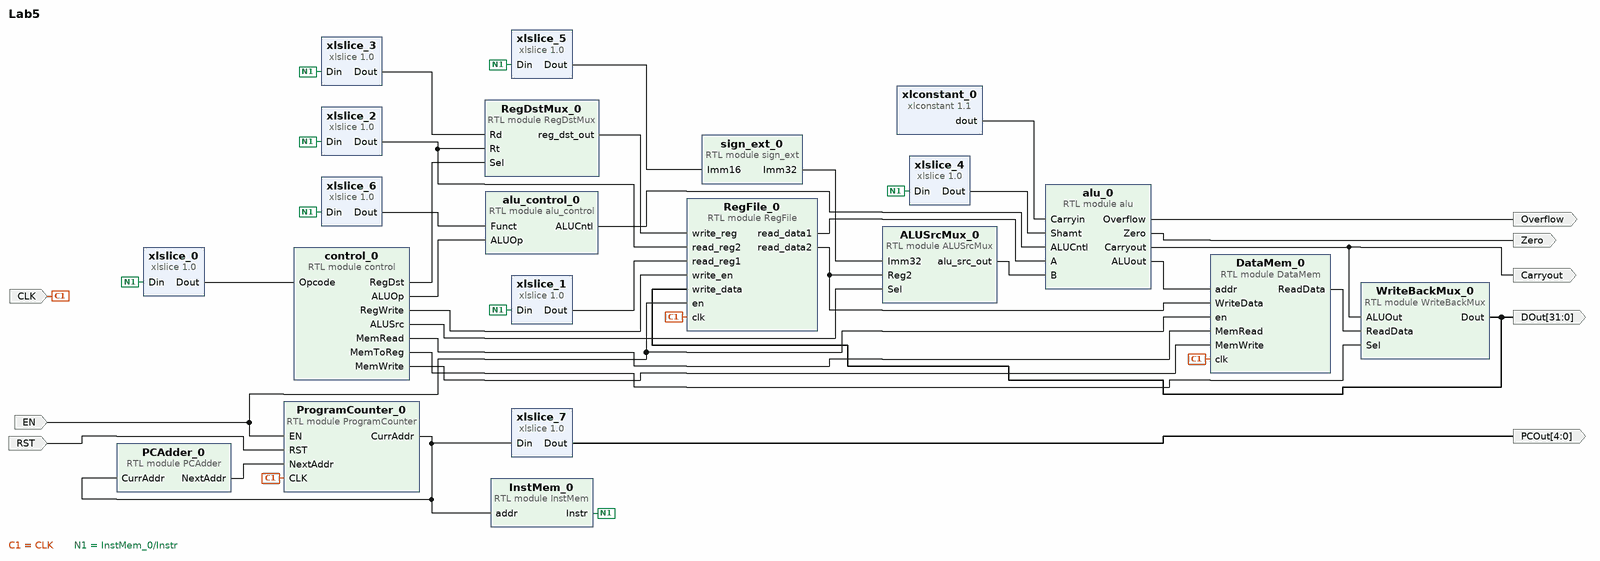
[diagram p0: block diagram of the top level]
# Vivado block design Lab5, xc7a35tcpg236-1, Vivado 2023.1.1
create_bd_design Lab5

create_bd_port -dir I RST
create_bd_port -dir I EN
create_bd_port -dir I CLK
create_bd_port -dir O -from 4 -to 0 PCOut
create_bd_port -dir O -from 31 -to 0 DOut
create_bd_port -dir O Carryout
create_bd_port -dir O Zero
create_bd_port -dir O Overflow

create_bd_cell -type module -reference ProgramCounter ProgramCounter_0
create_bd_cell -type module -reference PCAdder PCAdder_0
create_bd_cell -type ip -vlnv xilinx.com:ip:xlslice:1.0 xlslice_0
set_property -dict {CONFIG.DIN_FROM 31 CONFIG.DIN_TO 26} [get_bd_cells xlslice_0]
create_bd_cell -type ip -vlnv xilinx.com:ip:xlslice:1.0 xlslice_1
set_property -dict {CONFIG.DIN_FROM 25 CONFIG.DIN_TO 21} [get_bd_cells xlslice_1]
create_bd_cell -type ip -vlnv xilinx.com:ip:xlslice:1.0 xlslice_2
set_property -dict {CONFIG.DIN_FROM 20 CONFIG.DIN_TO 16} [get_bd_cells xlslice_2]
create_bd_cell -type ip -vlnv xilinx.com:ip:xlslice:1.0 xlslice_3
set_property -dict {CONFIG.DIN_FROM 15 CONFIG.DIN_TO 11} [get_bd_cells xlslice_3]
create_bd_cell -type ip -vlnv xilinx.com:ip:xlslice:1.0 xlslice_4
set_property -dict {CONFIG.DIN_FROM 10 CONFIG.DIN_TO 6} [get_bd_cells xlslice_4]
create_bd_cell -type ip -vlnv xilinx.com:ip:xlslice:1.0 xlslice_5
set_property -dict {CONFIG.DIN_FROM 15} [get_bd_cells xlslice_5]
create_bd_cell -type ip -vlnv xilinx.com:ip:xlslice:1.0 xlslice_6
set_property -dict {CONFIG.DIN_FROM 5} [get_bd_cells xlslice_6]
create_bd_cell -type ip -vlnv xilinx.com:ip:xlslice:1.0 xlslice_7
set_property -dict {CONFIG.DIN_FROM 6 CONFIG.DIN_TO 2} [get_bd_cells xlslice_7]
create_bd_cell -type module -reference RegFile RegFile_0
create_bd_cell -type module -reference sign_ext sign_ext_0
create_bd_cell -type module -reference RegDstMux RegDstMux_0
create_bd_cell -type module -reference alu alu_0
create_bd_cell -type module -reference alu_control alu_control_0
create_bd_cell -type module -reference ALUSrcMux ALUSrcMux_0
create_bd_cell -type module -reference DataMem DataMem_0
create_bd_cell -type ip -vlnv xilinx.com:ip:xlconstant:1.1 xlconstant_0
set_property -dict {CONFIG.CONST_VAL 0} [get_bd_cells xlconstant_0]
create_bd_cell -type module -reference WriteBackMux WriteBackMux_0
create_bd_cell -type module -reference InstMem InstMem_0
create_bd_cell -type module -reference control control_0

# ---- connections ----

connect_bd_net [get_bd_pins ALUSrcMux_0/alu_src_out] [get_bd_pins alu_0/B]
connect_bd_net [get_bd_ports CLK] [get_bd_pins ProgramCounter_0/CLK] [get_bd_pins RegFile_0/clk] [get_bd_pins DataMem_0/clk]
connect_bd_net [get_bd_pins DataMem_0/ReadData] [get_bd_pins WriteBackMux_0/ReadData]
connect_bd_net [get_bd_ports EN] [get_bd_pins ProgramCounter_0/EN] [get_bd_pins RegFile_0/en] [get_bd_pins DataMem_0/en]
connect_bd_net [get_bd_pins InstMem_0/Instr] \
  [get_bd_pins xlslice_0/Din] [get_bd_pins xlslice_1/Din] [get_bd_pins xlslice_2/Din] [get_bd_pins xlslice_3/Din] \
  [get_bd_pins xlslice_4/Din] [get_bd_pins xlslice_5/Din] [get_bd_pins xlslice_6/Din]
connect_bd_net [get_bd_pins PCAdder_0/NextAddr] [get_bd_pins ProgramCounter_0/NextAddr]
connect_bd_net [get_bd_pins ProgramCounter_0/CurrAddr] [get_bd_pins PCAdder_0/CurrAddr] [get_bd_pins xlslice_7/Din] [get_bd_pins InstMem_0/addr]
connect_bd_net [get_bd_ports RST] [get_bd_pins ProgramCounter_0/RST]
connect_bd_net [get_bd_pins RegDstMux_0/reg_dst_out] [get_bd_pins RegFile_0/write_reg]
connect_bd_net [get_bd_pins RegFile_0/read_data1] [get_bd_pins alu_0/A]
connect_bd_net [get_bd_pins RegFile_0/read_data2] [get_bd_pins ALUSrcMux_0/Reg2] [get_bd_pins DataMem_0/WriteData]
connect_bd_net [get_bd_pins WriteBackMux_0/Dout] [get_bd_ports DOut] [get_bd_pins RegFile_0/write_data]
connect_bd_net [get_bd_pins alu_0/ALUout] [get_bd_pins DataMem_0/addr]
connect_bd_net [get_bd_pins alu_0/Carryout] [get_bd_ports Carryout] [get_bd_pins WriteBackMux_0/ALUOut]
connect_bd_net [get_bd_pins alu_0/Overflow] [get_bd_ports Overflow]
connect_bd_net [get_bd_pins alu_0/Zero] [get_bd_ports Zero]
connect_bd_net [get_bd_pins alu_control_0/ALUCntl] [get_bd_pins alu_0/ALUCntl]
connect_bd_net [get_bd_pins control_0/ALUOp] [get_bd_pins alu_control_0/ALUOp]
connect_bd_net [get_bd_pins control_0/ALUSrc] [get_bd_pins ALUSrcMux_0/Sel]
connect_bd_net [get_bd_pins control_0/MemRead] [get_bd_pins DataMem_0/MemRead]
connect_bd_net [get_bd_pins control_0/MemToReg] [get_bd_pins WriteBackMux_0/Sel]
connect_bd_net [get_bd_pins control_0/MemWrite] [get_bd_pins DataMem_0/MemWrite]
connect_bd_net [get_bd_pins control_0/RegDst] [get_bd_pins RegDstMux_0/Sel]
connect_bd_net [get_bd_pins control_0/RegWrite] [get_bd_pins RegFile_0/write_en]
connect_bd_net [get_bd_pins sign_ext_0/Imm32] [get_bd_pins ALUSrcMux_0/Imm32]
connect_bd_net [get_bd_pins xlconstant_0/dout] [get_bd_pins alu_0/Carryin]
connect_bd_net [get_bd_pins xlslice_0/Dout] [get_bd_pins control_0/Opcode]
connect_bd_net [get_bd_pins xlslice_1/Dout] [get_bd_pins RegFile_0/read_reg1]
connect_bd_net [get_bd_pins xlslice_2/Dout] [get_bd_pins RegDstMux_0/Rt] [get_bd_pins RegFile_0/read_reg2]
connect_bd_net [get_bd_pins xlslice_3/Dout] [get_bd_pins RegDstMux_0/Rd]
connect_bd_net [get_bd_pins xlslice_4/Dout] [get_bd_pins alu_0/Shamt]
connect_bd_net [get_bd_pins xlslice_5/Dout] [get_bd_pins sign_ext_0/Imm16]
connect_bd_net [get_bd_pins xlslice_6/Dout] [get_bd_pins alu_control_0/Funct]
connect_bd_net [get_bd_pins xlslice_7/Dout] [get_bd_ports PCOut]

validate_bd_design
save_bd_design
